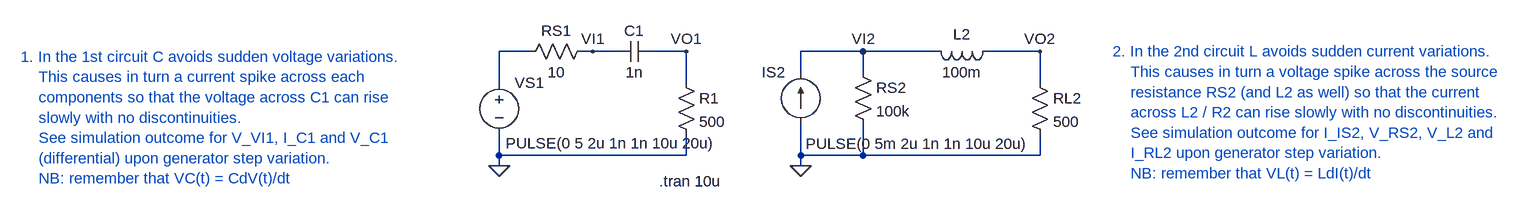
[diagram p0: schematic __RC_RL_Step_Response.asc]
__RC_RL_Step_Response.asc, the LTspice schematic file:
Version 4
SHEET 1 1936 1092
WIRE 80 96 32 96
WIRE 176 96 160 96
WIRE 208 96 176 96
WIRE 320 96 272 96
WIRE 592 96 496 96
WIRE 704 96 592 96
WIRE 864 96 784 96
WIRE 496 128 496 96
WIRE 592 128 592 96
WIRE 32 144 32 96
WIRE 320 144 320 96
WIRE 864 144 864 96
WIRE 32 256 32 224
WIRE 320 256 320 224
WIRE 320 256 32 256
WIRE 496 256 496 208
WIRE 592 256 592 208
WIRE 592 256 496 256
WIRE 864 256 864 224
WIRE 864 256 592 256
WIRE 32 272 32 256
WIRE 496 272 496 256
FLAG 32 272 0
FLAG 496 272 0
FLAG 592 96 VI2
FLAG 864 96 VO2
FLAG 320 96 VO1
FLAG 176 96 VI1
SYMBOL voltage 32 128 R0
WINDOW 3 10 109 Left 2
WINDOW 123 0 0 Left 0
WINDOW 39 0 0 Left 0
SYMATTR InstName VS1
SYMATTR Value PULSE(0 5 2u 1n 1n 10u 20u)
SYMBOL cap 272 80 R90
WINDOW 0 0 32 VBottom 2
WINDOW 3 32 32 VTop 2
SYMATTR InstName C1
SYMATTR Value 1n
SYMBOL res 304 128 R0
SYMATTR InstName R1
SYMATTR Value 500
SYMBOL res 176 80 R90
WINDOW 0 0 56 VBottom 2
WINDOW 3 32 56 VTop 2
SYMATTR InstName RS1
SYMATTR Value 10
SYMBOL current 496 208 R180
WINDOW 0 24 80 Left 2
WINDOW 3 -352 -30 Left 2
WINDOW 123 0 0 Left 0
WINDOW 39 0 0 Left 0
SYMATTR InstName IS2
SYMATTR Value PULSE(0 5m 2u 1n 1n 10u 20u)
SYMBOL res 576 112 R0
SYMATTR InstName RS2
SYMATTR Value 100k
SYMBOL res 848 128 R0
SYMATTR InstName RL2
SYMATTR Value 500
SYMBOL ind 800 80 R90
WINDOW 0 5 56 VBottom 2
WINDOW 3 32 56 VTop 2
SYMATTR InstName L2
SYMATTR Value 100m
TEXT 278 296 Left 2 !.tran 10u
TEXT 976 96 Left 2 ;2. In the 2nd circuit L avoids sudden current variations.\n    This causes in turn a voltage spike across the source\n    resistance RS2 (and L2 as well) so that the current\n    across L2 / R2 can rise slowly with no discontinuities.\n    See simulation outcome for I_IS2, V_RS2, V_L2 and\n    I_RL2 upon generator step variation.\n    NB: remember that VL(t) = LdI(t)/dt
TEXT -704 104 Left 2 ;1. In the 1st circuit C avoids sudden voltage variations.\n    This causes in turn a current spike across each\n    components so that the voltage across C1 can rise\n    slowly with no discontinuities.\n    See simulation outcome for V_VI1, I_C1 and V_C1\n    (differential) upon generator step variation.\n    NB: remember that VC(t) = CdV(t)/dt

The netlist it stands for:
* __RC_RL_Step_Response.asc
VS1 N001 0 PULSE(0 5 2u 1n 1n 10u 20u)
C1 VO1 VI1 1n
R1 VO1 0 500
RS1 VI1 N001 10
IS2 0 VI2 PULSE(0 5m 2u 1n 1n 10u 20u)
RS2 VI2 0 100k
RL2 VO2 0 500
L2 VO2 VI2 100m
.tran 10u
* 2. In the 2nd circuit L avoids sudden current variations.
*     This causes in turn a voltage spike across the source
*     resistance RS2 (and L2 as well) so that the current
*     across L2 / R2 can rise slowly with no discontinuities.
*     See simulation outcome for I_IS2, V_RS2, V_L2 and
*     I_RL2 upon generator step variation.
*     NB: remember that VL(t) = LdI(t)/dt
* 1. In the 1st circuit C avoids sudden voltage variations.
*     This causes in turn a current spike across each
*     components so that the voltage across C1 can rise
*     slowly with no discontinuities.
*     See simulation outcome for V_VI1, I_C1 and V_C1
*     (differential) upon generator step variation.
*     NB: remember that VC(t) = CdV(t)/dt
.backanno
.end